# EAGLE board H19R00 (EAGLE 9.6.2)
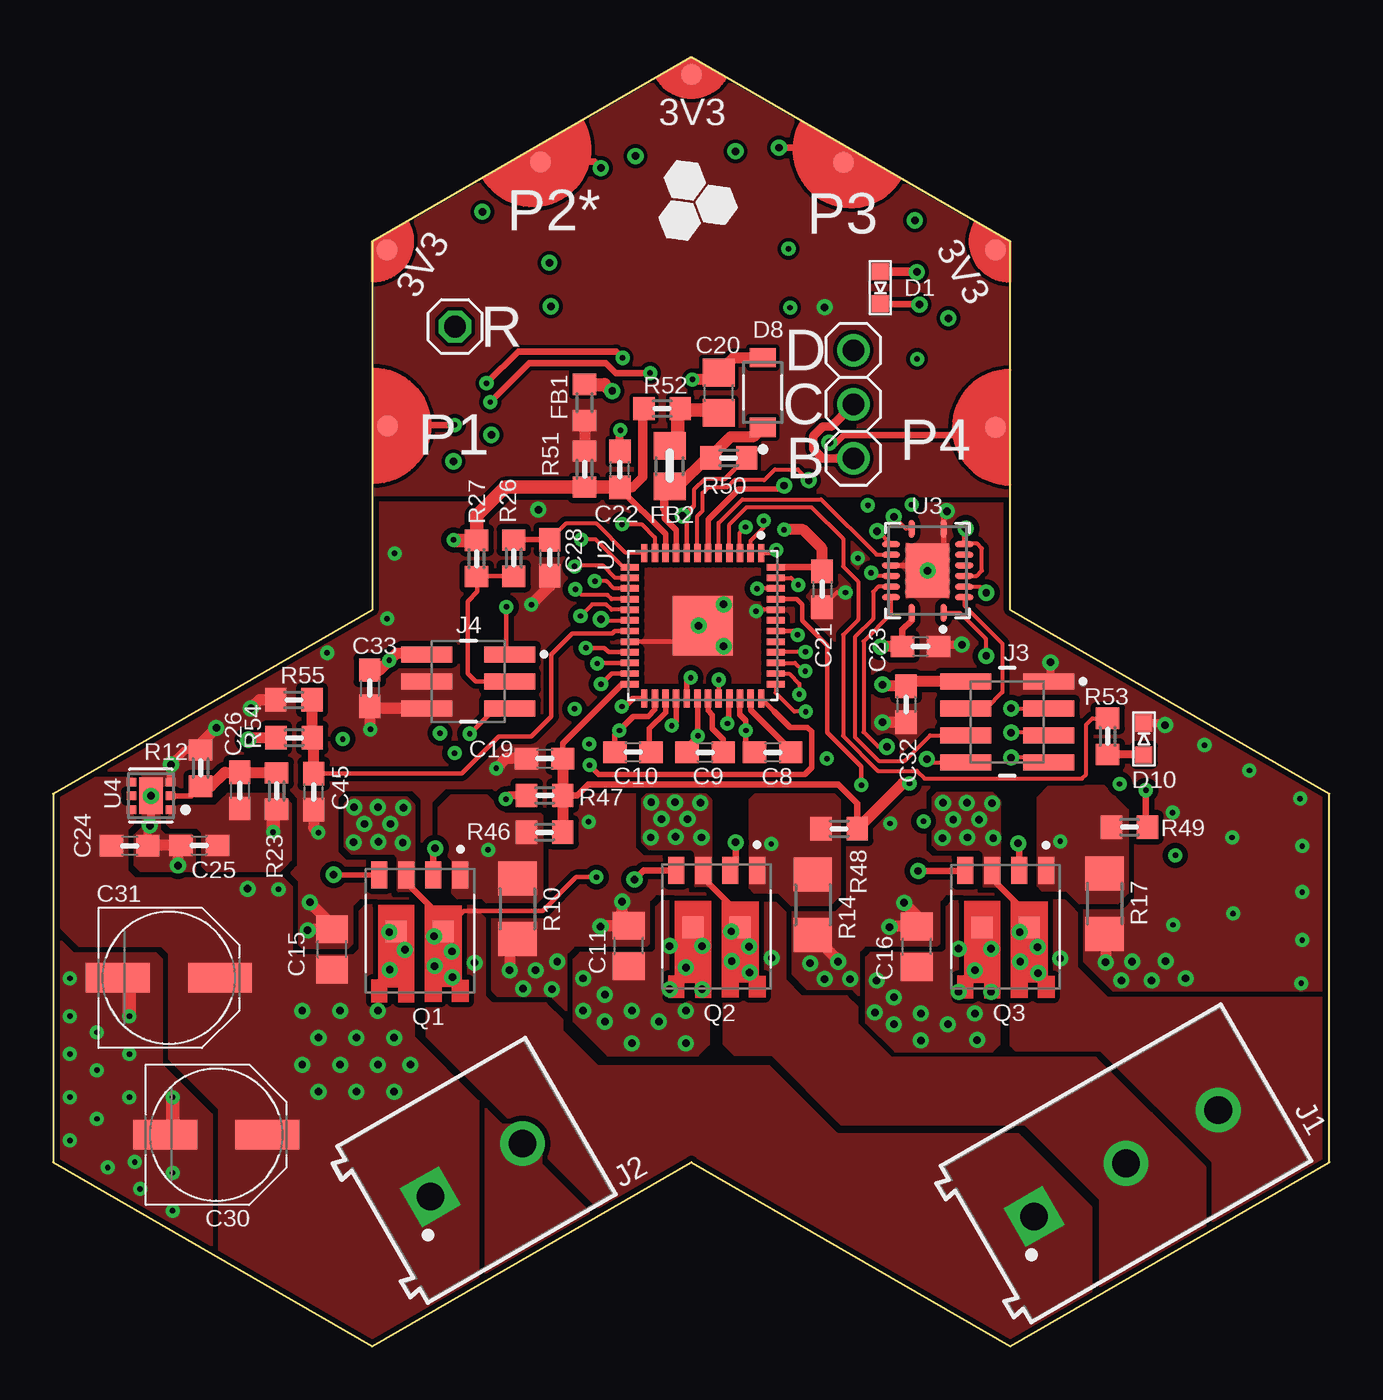
[diagram p3: board, top side]
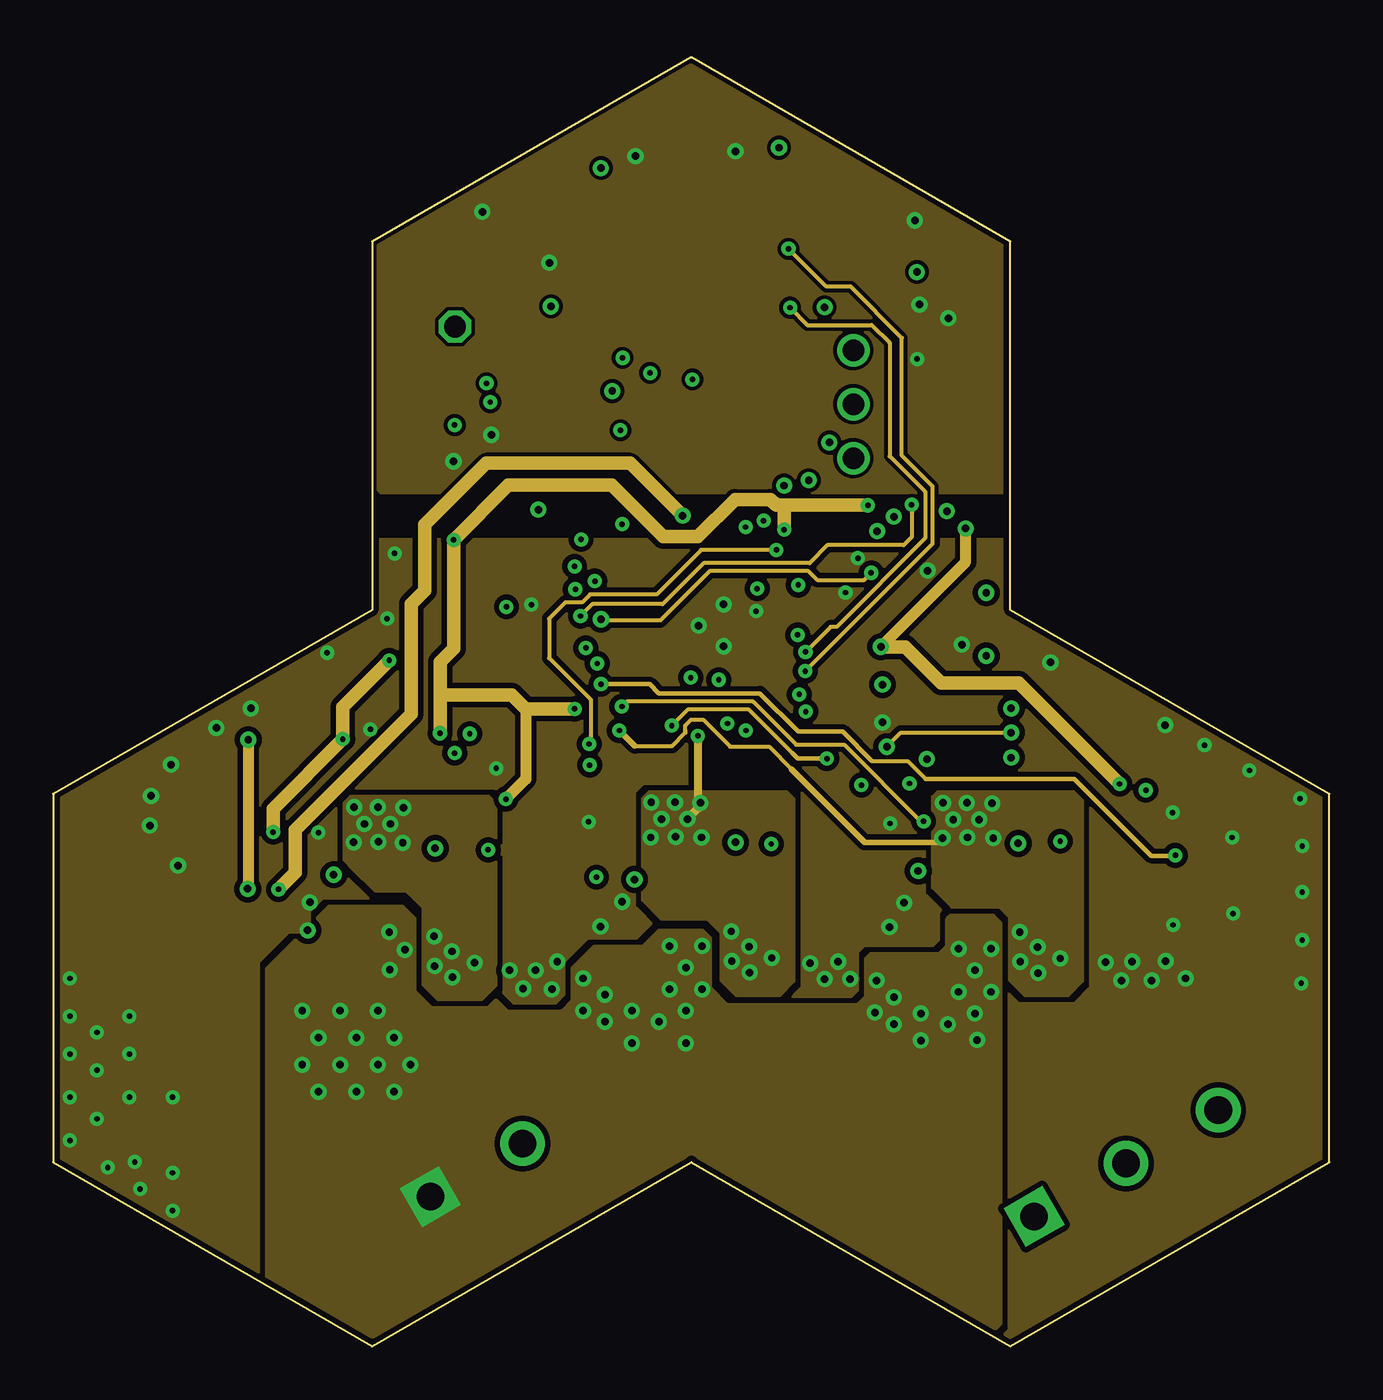
[diagram p4: board, inner layer Route2]
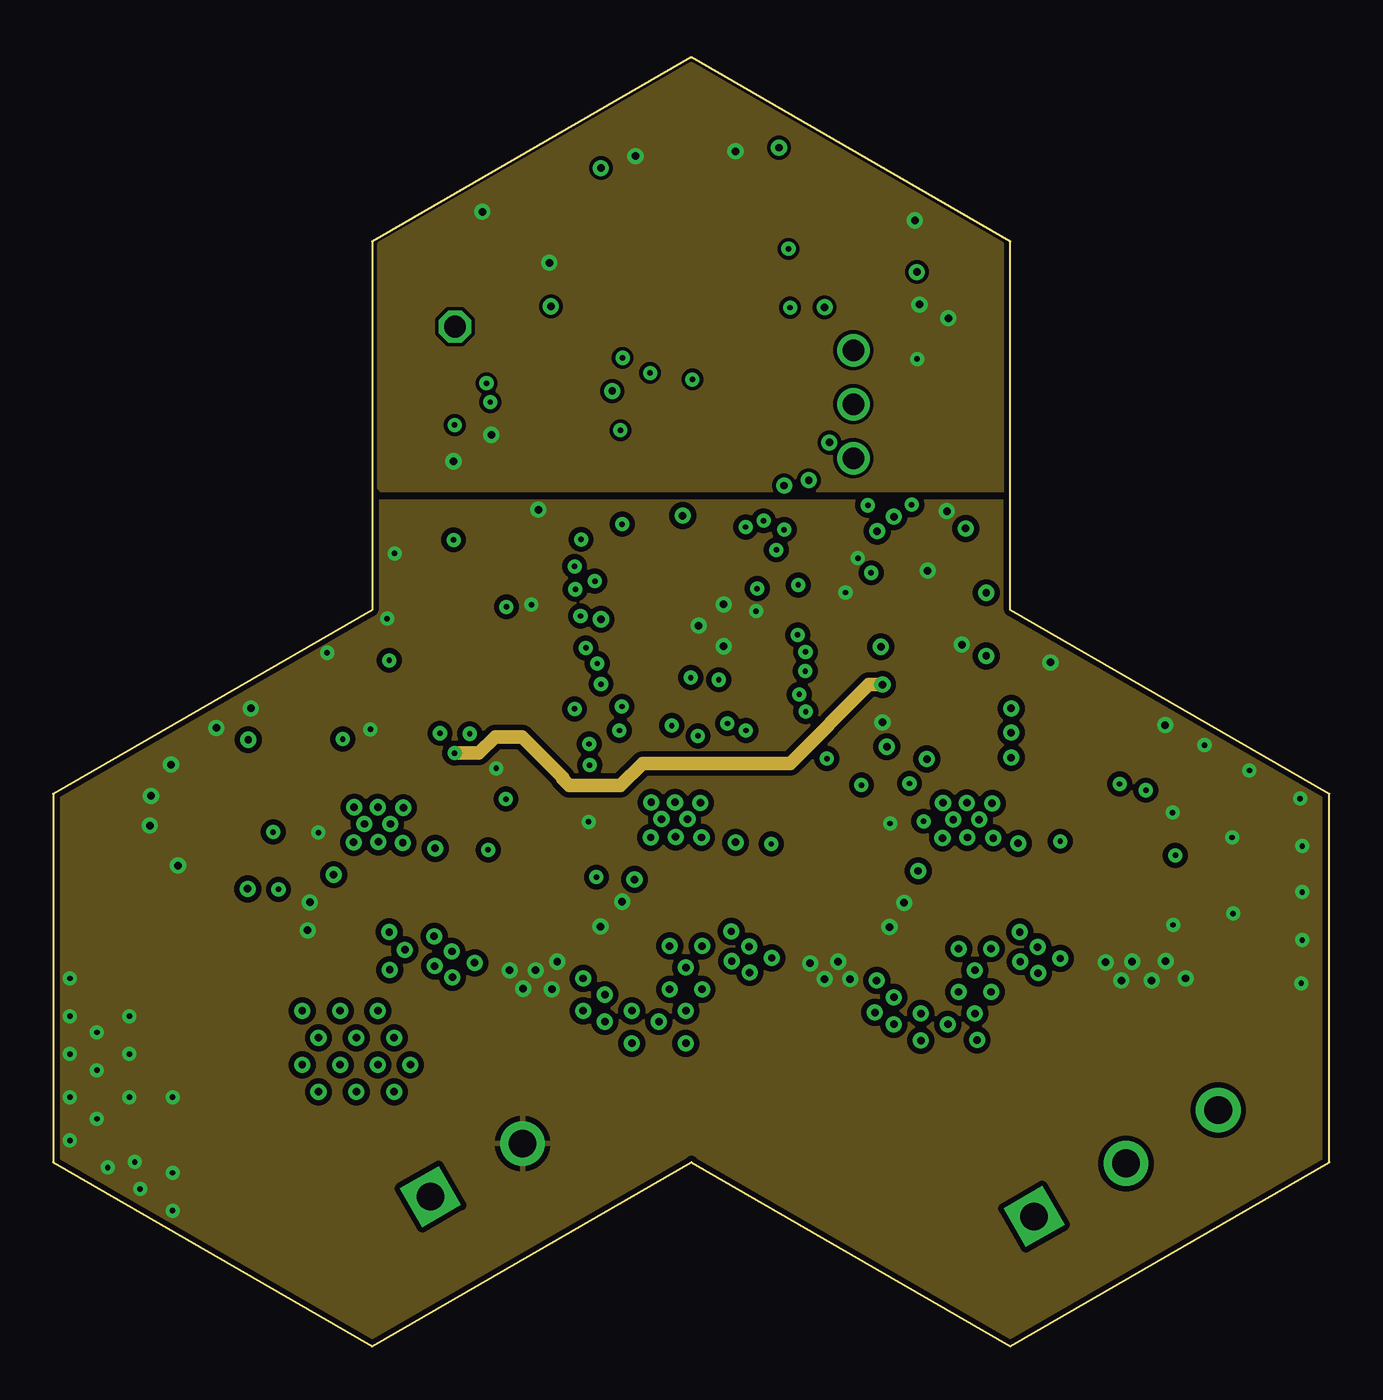
[diagram p5: board, inner layer Route15]
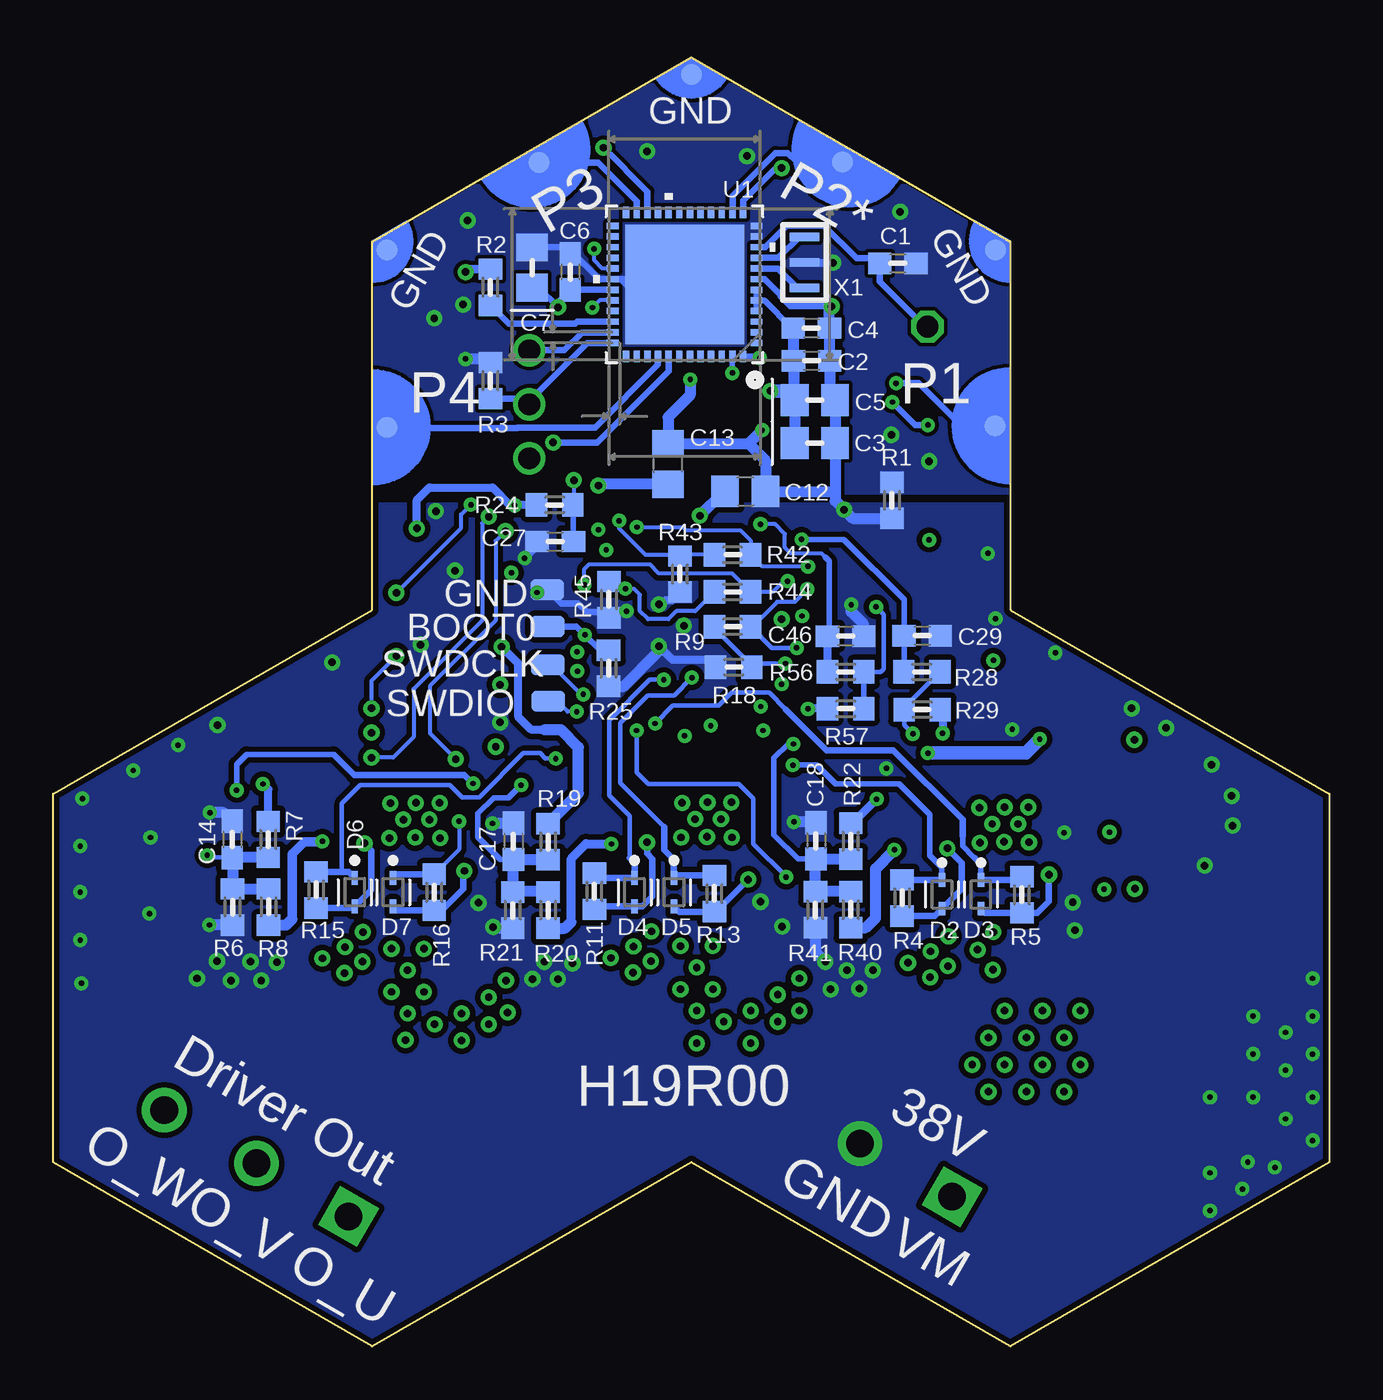
[diagram p6: board, bottom side, seen from below]

Size 60 x 60.62 mm. Coordinates in mm from the lower left corner, seen from the top.
Copper layers (1*2+15*16): Top 0.035mm / dielectric 0.175mm / Route2 0.035mm / dielectric 1.11mm / Route15 0.035mm / dielectric 0.175mm / Bottom 0.035mm
Design rules "4_layer *": minimum track width 7mil, minimum drill 10mil, track to track 7mil, track to pad 7mil, pad to pad 6mil, via to via 7mil, smd to smd 0mil, copper to edge 1mil, drill to drill 8mil, minimum pad ring 10mil, minimum via ring 8mil, stop-mask expansion 2mil, vias tented up to drill 15mil, thermal gap 10mil

## Footprints (pad centres in the part's own frame; a part is rotated, then mirrored left to right if it is on the bottom)
PAD4 = smd 1.6 x 1: P$1 0,0
C-0603 = smd 1.1 x 1: 1 -0.85,0; 2 0.85,0
C-0805-POL = smd 1.3 x 1.5: 1 -0.95,0; 2 0.95,0
C-0805 = smd 1.3 x 1.5: 1 -0.95,0; 2 0.95,0
PANASONIC_D = smd 3 x 1.4: + 2.4,0; - -2.4,0
VLMS1300-GS08 = smd 0.8 x 0.8: A 0,0.75; C 0,-0.75
STMICROELECTRONICS_BAT30KFILM_0 = smd 0.65 x 0.3: A 0.675,0; C -0.675,0
ONSEMI_MMSD4448_0 = smd 0.914 x 1.219: 1 -1.638,0; 2 1.638,0
FB-TDK_MMZ1608Y300B = smd 1 x 1.1: 1 -0.85,0; 2 0.85,0
FB-0805 = smd 1.3 x 1.5: 1 -0.95,0; 2 0.95,0
691213710003 = drill 1.3 pad 2.1 square: 1 -5,0 | drill 1.3 pad 2.1: 2 0,0; 3 5,0
691213710002 = drill 1.3 pad 2.1 square: 1 -2.5,0 | drill 1.3 pad 2.1: 2 2.5,0
AMPHENOL_20021121-00008T4LF = smd 0.76 x 2.4: 1 -1.905,1.95; 2 -1.905,-1.95; 3 -0.635,1.95; 4 -0.635,-1.95; 5 0.635,1.95; 6 0.635,-1.95; 7 1.905,1.95; 8 1.905,-1.95
AMPHENOL_20021121-00006C1LF = smd 0.76 x 2.4: 1 -1.27,1.95; 2 -1.27,-1.95; 3 0,1.95; 4 0,-1.95; 5 1.27,1.95; 6 1.27,-1.95
PJQ5866A_R2_00001-8-POWERTDFN = smd 1.27 x 0.75: 1 -2.67,1.905; 2 -2.67,0.635; 3 -2.67,-0.635; 4 -2.67,-1.905 | smd 1 x 1: 5_6 0,-1.107; 7_8 0,1.107
1X01 = drill 1.016 octagon: 1 0,0
R-0603 = smd 1 x 1.1: 1 -0.85,0; 2 0.85,0
R1206 = smd 1.6 x 1.803: 1 -1.422,0; 2 1.422,0
1X03 = drill 1.016: 1 -2.54,0; 2 0,0; 3 2.54,0
HEXABITZ_ICS_QFN_B1CEU6_STM-L = smd 0.55 x 0.3: 1 -3.38,2.751; 2 -3.38,2.251; 3 -3.38,1.75; 4 -3.38,1.25; 5 -3.38,0.75; 6 -3.38,0.25; 7 -3.38,-0.25; 8 -3.38,-0.75; 9 -3.38,-1.25; 10 -3.38,-1.75; 11 -3.38,-2.251; 12 -3.38,-2.751; 25 3.38,-2.751; 26 3.38,-2.251; 27 3.38,-1.75; 28 3.38,-1.25; 29 3.38,-0.75; 30 3.38,-0.25; 31 3.38,0.25; 32 3.38,0.75; 33 3.38,1.25; 34 3.38,1.75; 35 3.38,2.251; 36 3.38,2.751 | smd 0.3 x 0.55: 13 -2.751,-3.38; 14 -2.251,-3.38; 15 -1.75,-3.38; 16 -1.25,-3.38; 17 -0.75,-3.38; 18 -0.25,-3.38; 19 0.25,-3.38; 20 0.75,-3.38; 21 1.25,-3.38; 22 1.75,-3.38; 23 2.251,-3.38; 24 2.751,-3.38; 37 2.751,3.38; 38 2.251,3.38; 39 1.75,3.38; 40 1.25,3.38; 41 0.75,3.38; 42 0.25,3.38; 43 -0.25,3.38; 44 -0.75,3.38; 45 -1.25,3.38; 46 -1.75,3.38; 47 -2.251,3.38; 48 -2.751,3.38 | smd 5.6 x 5.6: 49 0,0
IC_STSPIN32F0A = smd 0.85 x 0.3: 1 -3.425,2.75; 2 -3.425,2.25; 3 -3.425,1.75; 4 -3.425,1.25; 5 -3.425,0.75; 6 -3.425,0.25; 7 -3.425,-0.25; 8 -3.425,-0.75; 9 -3.425,-1.25; 10 -3.425,-1.75; 11 -3.425,-2.25; 12 -3.425,-2.75; 25 3.425,-2.75; 26 3.425,-2.25; 27 3.425,-1.75; 28 3.425,-1.25; 29 3.425,-0.75; 30 3.425,-0.25; 31 3.425,0.25; 32 3.425,0.75; 33 3.425,1.25; 34 3.425,1.75; 35 3.425,2.25; 36 3.425,2.75 | smd 0.3 x 0.85: 13 -2.75,-3.425; 14 -2.25,-3.425; 15 -1.75,-3.425; 16 -1.25,-3.425; 17 -0.75,-3.425; 18 -0.25,-3.425; 19 0.25,-3.425; 20 0.75,-3.425; 21 1.25,-3.425; 22 1.75,-3.425; 23 2.25,-3.425; 24 2.75,-3.425; 37 2.75,3.425; 38 2.25,3.425; 39 1.75,3.425; 40 1.25,3.425; 41 0.75,3.425; 42 0.25,3.425; 43 -0.25,3.425; 44 -0.75,3.425; 45 -1.25,3.425; 46 -1.75,3.425; 47 -2.25,3.425; 48 -2.75,3.425 | smd 2.8 x 2.8: 49 0,0
TEXAS_INSTRUMENTS_AM26LV32EIRGYR_0 = smd 0.85 x 0.28: 1 -1.975,-0.75; 8 1.975,-0.75; 9 1.975,0.75; 16 -1.975,0.75 | smd 0.28 x 0.85: 2 -1.25,-1.725; 3 -0.75,-1.725; 4 -0.25,-1.725; 5 0.25,-1.725; 6 0.75,-1.725; 7 1.25,-1.725; 10 1.25,1.725; 11 0.75,1.725; 12 0.25,1.725; 13 -0.25,1.725; 14 -0.75,1.725; 15 -1.25,1.725 | smd 2.55 x 2.05: 17 0,0
ON_SEMI_NCP730BMTADJTBG_0 = smd 0.45 x 0.4: 1 -0.925,0.65; 2 -0.925,0; 3 -0.925,-0.65; 4 0.925,-0.65; 5 0.925,0; 6 0.925,0.65 | smd 1.12 x 1.72: 7 0,0
HEXABIT_17.32_X3_NO_P1_P2_P3_P4_P5_P6_P11_P12 = smd 1 x 1 bottom: PAD_PD1 -21.88,-6.86; PAD_PD2 -21.84,7.39; PAD_PD12 -25.99,0.24 | smd 1 x 1 rotated 240 bottom: PAD_PD3 -9.468,-14.037; PAD_PD8 -9.394,14.542 | smd 1 x 1 rotated 60 bottom: PAD_PD17 -17.741,-14.056 | smd 1 x 1 rotated 300 bottom: PAD_PD19 -17.727,14.55 | smd 1 x 1: PAD_PU1 -21.88,-6.86; PAD_PU2 -21.84,7.39; PAD_PU12 -25.99,0.24 | smd 1 x 1 rotated 240: PAD_PU3 -9.468,-14.037; PAD_PU8 -9.394,14.542 | smd 1 x 1 rotated 60: PAD_PU17 -17.741,-14.056 | smd 1 x 1 rotated 300: PAD_PU19 -17.727,14.55
XTALL_CSTCE8M00G52 = smd 1.4 x 0.4: P$1 0,1.2; P$2 0,0; P$3 0,-1.2

## Placement (x,y rotation side)
BOOT0  PAD4  [PAD4]  36.75,33.86 0 bottom
C1  100nF  [C-0603]  20.29,50.93 180 bottom
C2  100nF  [C-0603]  24.34,46.35 180 bottom
C3  4.7uF  [C-0805-POL]  24.19,42.48 0 bottom
C4  100nF  [C-0603]  24.35,47.88 180 bottom
C5  1uF  [C-0805-POL]  24.19,44.51 0 bottom
C6  100nF  [C-0603]  35.69,50.53 270 bottom
C7  4.7uF  [C-0805-POL]  37.49,50.74 90 bottom
C8  470nF  [C-0603]  33.83,27.94 0 top
C9  470nF  [C-0603]  30.65,27.94 0 top
C10  470nF  [C-0603]  27.26,27.95 0 top
C11  150nF  [C-0805]  27.06,18.83 90 top
C12  10uF  [C-0805]  27.46,40.21 0 bottom
C13  10uF  [C-0805]  31.09,41.5 90 bottom
C14  33pF  [C-0603]  51.58,23.84 270 bottom
C15  150nF  [C-0805]  13.11,18.67 90 top
C16  150nF  [C-0805]  40.6,18.8 90 top
C17  33pF  [C-0603]  38.36,23.75 270 bottom
C18  33pF  [C-0603]  24.14,23.77 270 bottom
C19  1nF  [C-0603]  23.11,27.64 0 top
C20  47uF  [C-0805]  31.3,44.85 90 top
C21  100nF  [C-0603]  36.15,35.61 270 top
C22  100nF  [C-0603]  26.65,41.24 90 top
C23  100nF  [C-0603]  40.78,32.91 180 top
C24  1uF  [C-0603]  3.6,23.54 180 top
C25  1uF  [C-0603]  6.87,23.56 0 top
C26  1nF  [C-0603]  8.77,26.15 270 top
C27  1nF  [C-0603]  36.4,37.85 0 bottom
C28  220pF  [C-0603]  23.35,37.09 90 top
C29  220pF  [C-0603]  19.14,33.42 180 bottom
C30  47uF  [PANASONIC_D]  7.66,9.95 0 top
C31  47uF  [PANASONIC_D]  5.44,17.34 0 top
C32  10nF  [C-0603]  40.09,30.19 270 top
C33  10nF  [C-0603]  14.89,30.96 270 top
C45  2.2nF  [C-0603]  12.25,26.08 90 top
C46  220pF  [C-0603]  22.74,33.4 180 bottom
D1  RED  [VLMS1300-GS08]  38.89,49.78 0 top
D2  BAT30KFILM  [STMICROELECTRONICS_BAT30KFILM_0]  18.21,21.26 270 bottom
D3  BAT30KFILM  [STMICROELECTRONICS_BAT30KFILM_0]  16.39,21.26 270 bottom
D4  BAT30KFILM  [STMICROELECTRONICS_BAT30KFILM_0]  32.67,21.36 270 bottom
D5  BAT30KFILM  [STMICROELECTRONICS_BAT30KFILM_0]  30.81,21.36 270 bottom
D6  BAT30KFILM  [STMICROELECTRONICS_BAT30KFILM_0]  45.82,21.36 270 bottom
D7  BAT30KFILM  [STMICROELECTRONICS_BAT30KFILM_0]  44.02,21.36 270 bottom
D8  MMSD4448ONSEMI_MMSD4448_0_0  [ONSEMI_MMSD4448_0]  33.36,44.86 90 top
D10  RED  [VLMS1300-GS08]  51.28,28.57 180 top
FB1  [FB-TDK_MMZ1608Y300B]  24.98,44.39 90 top
FB2  22uH  [FB-0805]  28.98,41.4 90 top
GND  PAD4  [PAD4]  36.77,35.58 0 bottom
J1  691213710003  [691213710003]  50.45,8.6 30 top
J2  691213710002  [691213710002]  19.9,8.29 30 top
J3  20021121-00008T4LFU  [AMPHENOL_20021121-00008T4LF]  44.86,29.37 270 top
J4  20021121-00006C1LF  [AMPHENOL_20021121-00006C1LF]  19.52,31.27 270 top
Q1  [PJQ5866A_R2_00001-8-POWERTDFN]  17.23,19.51 270 top
Q2  [PJQ5866A_R2_00001-8-POWERTDFN]  31.19,19.72 270 top
Q3  [PJQ5866A_R2_00001-8-POWERTDFN]  44.78,19.7 270 top
R  [1X01]  18.89,47.96 0 top
R1  0.0R  [R-0603]  20.56,39.79 270 bottom
R2  270R  [R-0603]  39.44,49.81 270 bottom
R3  10K  [R-0603]  39.44,45.42 270 bottom
R4  100  [R-0603]  20.09,21.08 90 bottom
R5  100  [R-0603]  14.46,21.23 90 bottom
R6  21K  [R-0603]  51.57,20.66 270 bottom
R7  21K  [R-0603]  49.89,23.84 270 bottom
R8  2.4K  [R-0603]  49.87,20.66 90 bottom
R9  10.5K  [R-0603]  28.06,33.85 0 bottom
R10  0.100R  [R1206]  21.82,20.57 90 top
R11  100  [R-0603]  34.55,21.4 90 bottom
R12  750K  [R-0603]  6.93,27.19 90 top
R13  100  [R-0603]  28.92,21.29 90 bottom
R14  0.100R  [R1206]  35.71,20.76 90 top
R15  100  [R-0603]  47.64,21.46 90 bottom
R16  100  [R-0603]  42.09,21.36 90 bottom
R17  0.100R  [R1206]  49.43,20.83 90 top
R18  2.4K  [R-0603]  28.01,31.94 0 bottom
R19  21K  [R-0603]  36.73,23.73 270 bottom
R20  2.4K  [R-0603]  36.73,20.51 90 bottom
R21  21K  [R-0603]  38.4,20.51 270 bottom
R22  21K  [R-0603]  22.5,23.76 270 bottom
R23  2.4M  [R-0603]  10.5,26.11 90 top
R24  12K  [R-0603]  36.43,39.58 180 bottom
R25  100K  [R-0603]  33.89,31.89 270 bottom
R26  1K  [R-0603]  21.65,37.07 90 top
R27  12K  [R-0603]  19.9,37.06 270 top
R28  1K  [R-0603]  19.16,31.72 180 bottom
R29  12K  [R-0603]  19.14,29.94 180 bottom
R40  2.4K  [R-0603]  22.5,20.54 90 bottom
R41  21K  [R-0603]  24.17,20.54 270 bottom
R42  10.5K  [R-0603]  28.06,37.23 0 bottom
R43  2.4K  [R-0603]  30.54,36.32 90 bottom
R44  10.5K  [R-0603]  28.06,35.48 0 bottom
R45  2.4K  [R-0603]  33.87,35.12 90 bottom
R46  2.2K  [R-0603]  23.11,24.18 180 top
R47  18K  [R-0603]  23.11,25.91 0 top
R48  2.2K  [R-0603]  36.95,24.34 180 top
R49  2.2K  [R-0603]  50.6,24.42 180 top
R50  DNP  [R-0603]  31.76,41.78 180 top
R51  DNP  [R-0603]  24.98,41.26 270 top
R52  0R  [R-0603]  28.63,44.1 180 top
R53  270R  [R-0603]  49.57,28.69 90 top
R54  180K  [R-0603]  11.33,28.62 0 top
R55  10K  [R-0603]  11.31,30.4 0 top
R56  1K  [R-0603]  22.74,31.72 180 bottom
R57  12K  [R-0603]  22.74,29.99 0 bottom
SWD  [1X03]  37.62,44.31 90 top
SWDCLK  PAD4  [PAD4]  36.75,32.05 180 bottom
SWDIO  PAD4  [PAD4]  36.72,30.34 0 bottom
U1  STM32G0B1CEU6N  [HEXABITZ_ICS_QFN_B1CEU6_STM-L]  30.32,49.94 180 bottom
U2  STSPIN32F0A  [IC_STSPIN32F0A]  30.54,33.89 270 top
U3  AM26LV32EIRGYRTEXAS_INSTRUMENTS_AM26LV32EIRGYR_0_0  [TEXAS_INSTRUMENTS_AM26LV32EIRGYR_0]  41.11,36.48 90 top
U4  NCP730BMTADJTBGON_SEMI_NCP730BMTADJTBG_0_0  [ON_SEMI_NCP730BMTADJTBG_0]  4.6,25.89 180 top
U$1  HEXABIT_17.32_X3_NO_P1_P2_P3_P4_P5_P6_P11_P12  [HEXABIT_17.32_X3_NO_P1_P2_P3_P4_P5_P6_P11_P12]  29.76,33.83 270 top
X1  8MHZ  [XTALL_CSTCE8M00G52]  24.68,50.97 180 bottom

## Tracks (layer width: path | path; a pad name or v marks a point on that pad's centre or on a via)
+5V  (via drill 0.25 pad 0.51, 0.35)
  Top 0.508: J3.2 40.32,31.27 C32.1 39.07,31.05 v38.99,31.12 | J4.2 17.52,32.6 16.13,32.6 v15.8,32.27 15.34,31.81 C33.1
  Top 0.635: R23.1 10.34,25.1 v10.34,24.19
  Route2 0.635: v10.34,24.19 10.34,25.28 v13.62,28.56 13.62,30.08 v15.8,32.27
  Route15 0.635: v18.87,27.9 20.02,27.9 20.78,28.66 22.05,28.66 23.95,26.75 23.95,26.68 24.26,26.37 26.67,26.37 27.71,27.41 34.65,27.41 38.36,31.12 v38.99,31.12
  Bottom 0.635: v13.62,28.56 14.28,27.9 v18.87,27.9
  pour Top (isolate 0.254, no thermals): 5.36,25.36 5.36,24.57 5.46,24.47 5.51,24.42 5.82,24.42 6.76,24.42 6.91,24.26 7.01,24.16 7.01,23.45 7.01,22.59 7.21,22.38 8.94,22.38 10.67,22.38 10.95,22.66 11.18,22.89 11.18,24.97 11.18,25.51 10.97,25.71 10.72,25.97 9.88,25.97 8.2,25.97 7.93,25.69 7.62,25.38 5.51,25.38 5.39,25.38
C
  Top 0.406: SWD.1 36.83,41.77 36.81,41.75 36.18,41.75 35.73,42.19 35.73,42.82 36.18,43.27 36.58,43.27 SWD.2
  Bottom 0.305: U1.36 34.89,47.19 37.62,44.46 SWD.2 37.88,44.57 R3.2
D
  Bottom 0.305: U1.35 33.71,47.68 35.14,47.68 35.96,46.85 SWD.3
ENC_A
  Top 0.178: U3.2 42.84,34.85 44.63,33.05 44.63,30.77 43.87,30 J3.4
ENC_B
  Top 0.178: U3.14 38.8,35.73 38.55,35.48 38.55,34.21 37.69,33.36 37.69,28.66 38.81,27.54 40.03,27.54 41.23,28.73 J3.6
ENC_I  (via drill 0.35)
  Top 0.178: U3.10 38.78,38.34 v38.74,38.34 | v41.07,27.62 41.23,27.46 J3.8
  Bottom 0.178: v38.74,38.34 39.19,37.88 39.19,34.14 42.29,31.05 42.29,28.84 v41.07,27.62
ENC_NA  (via drill 0.35)
  Top 0.178: U3.1 42.62,34.51 43.84,33.28 43.84,32.47 v43.87,32.47 | v45.04,30 J3.3
  Bottom 0.178: v43.87,32.47 45.04,31.3 v45.04,30
ENC_NB  (via drill 0.35)
  Top 0.178: U3.15 39.39,34.44 38.1,33.15 38.1,28.89 38.79,28.2 v39.19,28.2 | v45.04,28.86 46.68,28.86 J3.5
  Route2 0.178: v39.19,28.2 39.85,28.86 v45.04,28.86
ENC_NI  (via drill 0.35)
  Top 0.178: U3.9 40.09,38.46 v39.52,39.02 | v45.04,27.69 46.58,27.69 J3.7
  Bottom 0.178: v39.52,39.02 39.83,38.72 39.83,34.14 43.05,30.92 43.05,28.66 44.02,27.69 v45.04,27.69
G0_USART1_RX  (via drill 0.25 pad 0.51)
  Top 0.178: v35.37,32.66 35.36,32.64 U2.40
  Route2 0.178: v34.65,48.85 35.46,48.04 38.48,48.04 39.32,47.2 39.32,41.87 41,40.19 41,38.01 36.83,33.84 36.55,33.84 v35.37,32.66
  Bottom 0.178: U1.32 34.31,49.19 v34.65,48.85
G0_USART1_TX  (via drill 0.25 pad 0.51)
  Top 0.178: U2.39 34.87,32.14 35.26,31.76 v35.36,31.76
  Route2 0.178: v35.36,31.76 41.35,37.75 41.35,40.44 39.9,41.89 39.9,47.43 37.49,49.84 36.35,49.84 v34.57,51.62
  Bottom 0.178: U1.29 34.18,50.69 34.57,51.09 v34.57,51.62
GND  (via drill 0.25 pad 0.51, 0.35)
  Top 0.305: D1.C 38.91,49.01 40.71,49.01 v40.73,48.99
  Bottom 0.305: C7.2 35.9,51.69 35.69,51.48 | C6.1 35.69,51.48 | 35.69,51.48 35.61,51.41 35.61,51.48 34.32,50.19 U1.30 33.06,50.19 33.04,50.18 33.29,50.18 33.05,49.94 U1.49
  Bottom 0.381: X1.P$2 23.35,50.98 v23.33,50.96
  Bottom 0.508: R3.1 39.61,46.44 v40.62,46.44
  other vias: 27.38,55.98 20.18,53.36 32.08,56.2 40.51,52.95 42.09,48.36 20.6,42.87 18.82,41.62
  pour Bottom (rank 2, no thermals): 45.07,40.1 15.08,40.18 15.08,51.69 30,60.42 45,51.85
  pour Route15 (rank 2): 15.39,40.24 44.63,40.24 44.65,40.21 44.65,51.85 30,60.36 15.29,51.85 15.29,40.34
  pour Route2 (rank 2): 15.37,40.16 44.6,40.16 44.63,40.14 44.63,51.77 29.97,60.28 15.27,51.77 15.27,40.27
GND1  (via drill 0.25 pad 0.51, 0.35)
  Top 0.178: U2.44 33.11,34.64 v33.05,34.58 | C21.2 36.85,35.45 v37.25,35.45
  Top 0.203: U2.20 29.6,33.14 v30.35,33.89
  Top 0.254: U3.12 40.86,36.73 U3.17 41.86,37.23 U3.8 41.86,39.12 v42.01,39.28
  Top 0.305: v31.52,34.89 31.35,34.89 v30.35,33.89
  Top 0.381: U4.3 5.52,27.35 v5.54,27.36 6.22,28.04 R12.2 | C24.1 4.45,24.39 v4.55,24.49 4.6,24.54 U4.7 | C23.1 41.72,33 v42.72,33 | D10.C 52.18,29.32 v52.27,29.22 | J3.1 46.89,31.36 v46.89,32.16 | C22.2 26.65,43.06 v26.67,43.09
  Top 0.508: R10.1 21.46,18.79 v21.46,17.69 | v25.73,19.74 25.77,19.78 C11.2 26.75,20.09 v26.75,20.91 | v11.96,19.57 12.02,19.62 C15.2 13.11,19.84 v12.07,20.89 | v39.32,19.72 39.35,19.75 C16.2 40.6,20.26 v40.01,20.86 | C24.1 4.46,23.56 C25.1 5.87,23.41 v5.87,22.61 | R55.1 9.69,30.4 v9.3,30 | R12.2 6.93,28.35 v7.67,29.09 | C32.2 v38.99,29.35 v38.99,29.34 | C19.1 21.28,27.64 v20.83,27.19 | C45.1 12.25,24.38 v12.47,24.16 | J4.6 14.99,30 C33.2 14.89,29.04 v14.91,29.01 | D8.2 32,46.5 C20.2 30.98,45.47 v30.05,45.47 | v22.48,34.88 23.35,35.75 C28.1 | R14.1 36.91,18.15 v36.91,18.09 | R17.1 49.48,19.36 v49.48,18.07
  Top 0.635: C31.- 3.58,16.79 v3.58,15.53 | v5.61,11.72 5.61,10.31 C30.-
  Bottom 0.178: GND.P$1 37.12,35.58 v37.25,35.45
  Bottom 0.305: v23.4,48.91 23.42,48.91 25.34,48.91 25.79,49.36 25.79,49.44 26.54,50.19 U1.7 | v30.35,33.89 30.36,33.89 | GND.P$1 36.12,34.93 35.31,34.93 34.9,34.53 33.45,34.53 33.4,34.58
  Bottom 0.381: R18.1 29.22,32.3 30.89,32.3 v31.52,32.93 | v31.52,34.89 31.41,34.89 31.2,35.1 30.91,35.1 R43.1 | R45.1 33.56,34.58 33.4,34.58 v33.05,34.58 | C27.1 37.25,37.69 37.85,37.09 v37.83,37.07
  Bottom 0.508: R21.2 39.26,19.66 v39.32,19.72 | R6.2 v52.66,19.82 | C14.1 52,25.1 v52.63,25.1 | C17.1 v39.34,24.6 v39.35,24.59 | 23.42,48.91 23.5,48.83 C4.1 23.5,46.37 C2.1 23.49,44.76 C5.2 C3.2 23.24,40.27 | 23.24,40.27 23.24,39.78 v22.81,39.35 22.4,38.94 R1.2 | 23.24,40.27 23.29,40.21 C12.2 26.51,41.65 27.31,42.45 | 27.31,42.45 C13.2 31.09,43.69 30.05,44.74 v30.05,45.47 | 27.31,42.45 v26.67,43.09 | C46.1 21.89,33.96 22.48,34.55 v22.48,34.88 | R41.2 24.17,18.56 v23.7,18.09 | C18.1 24.18,24.67 v25.17,24.67 | R25.2 33.18,31.04 31.52,32.7 v31.52,32.93
  other vias: 22.68,17.69 22.1,16.82 23.44,16.8 35.59,18.02 36.27,17.28 37.47,17.28 50.72,18.09 50.22,17.2 51.64,17.2 52.3,18.12 53.24,17.3 4.6,25.89 41.11,36.48 0.79,17.3 0.79,15.53 0.79,13.75 0.79,11.72 0.79,9.68 2.57,8.41 4.09,7.4 5.61,6.38 5.61,8.16 3.84,8.67 2.06,10.7 2.06,14.76 3.58,13.75 2.06,12.99 3.58,11.72 12.88,32.62 16.05,37.29 15.7,34.22 54.13,28.28 56.24,27.08 58.62,25.76 58.73,23.53 58.73,21.37 58.73,19.11 58.67,17.08 55.47,20.35 55.42,23.93
  pour Top (isolate 0.254, rank 3, no thermals): -0.28,8.29 -0.28,0.24 0.31,-0.35 0.97,-1.01 44.5,-1.01 58.73,-1.01 59.49,-0.25 60.35,0.62 60.35,13.8 60.35,37.52 58.01,39.86 15.8,39.86 3.89,39.86 2.01,37.98 -0.28,35.69
  pour Route15 (isolate 0.254): -0.43,35.77 -0.43,0.31 0.81,-0.93 58.57,-0.93 60.2,0.69 60.2,37.6 58.04,39.76 3.56,39.76
  pour Bottom (isolate 0.254, rank 3, no thermals): -0.38,8.06 -0.38,0.01 0.2,-0.58 0.86,-1.24 44.4,-1.24 58.62,-1.24 59.39,-0.48 60.25,0.39 60.25,13.57 60.25,37.29 57.91,39.63 15.7,39.63 3.79,39.63 1.91,37.75 -0.38,35.47
  pour Route2 (isolate 0.254, rank 3, no thermals): -0.3,35.31 -0.3,-0.15 0.94,-1.39 58.7,-1.39 60.33,0.24 60.33,37.14 59.51,37.95 2.34,37.95
H1  (via drill 0.25 pad 0.51)
  Top 0.203: v21.31,34.78 21.31,32.7 J4.1
  Bottom 0.203: R56.1 21.1,31.72 20.96,31.86 20.96,34.42 v21.31,34.78
  Bottom 0.254: R57.2 R56.1
H2
  Top 0.203: R26.1 19.94,36.22 | 19.94,36.22 19.92,36.22 R27.2 | J4.3 19.86,31.27 19.48,31.66 19.48,35.03 19.94,35.49 19.94,36.22
H3  (via drill 0.25 pad 0.51)
  Top 0.203: J4.5 20.78,30 v19.58,28.81
  Bottom 0.203: v19.58,28.81 19.99,29.22 R29.2 19.99,30.04 R28.1
HSU  (via drill 0.25 pad 0.51)
  Top 0.254: U2.33 31.77,30.45 31.77,29.29 v31.7,29.29
  Bottom 0.203: v31.7,29.29 30.86,30.13 28.7,30.13 28.09,30.74 26.34,30.74 25.55,29.95
  Bottom 0.254: 17.25,24.01 17.25,23.53 16.72,23 16.69,23 16.39,22.69 D3.C
  Bottom 0.305: D3.C 14.61,21.93 R5.2 | 25.55,29.95 23.62,28.02 20.5,28.02 17.25,24.77 17.25,24.01
HSV  (via drill 0.25 pad 0.51)
  Top 0.254: U2.29 29.8,31.27 v29.97,31.45
  Bottom 0.203: v29.97,31.45 30.81,30.61 32.06,30.61 33.35,29.32 33.35,26.5 31.27,24.42
  Bottom 0.305: R13.2 30.7,22.14 D5.C 30.81,22.89 31.27,23.35 31.27,24.42
HSW  (via drill 0.25 pad 0.51)
  Top 0.254: U2.25 27.24,30.47 26.8,30.03 v26.73,30.09
  Route2 0.178: v26.73,30.09 26.96,30.32 32.91,30.32 34.93,28.3 37.19,28.3 40.79,24.7 v40.92,24.7
  Bottom 0.178: v40.92,24.7 40.92,23.37 R16.2
  Bottom 0.305: R16.2 43.85,22.21 D7.C
ISNSU  (via drill 0.25 pad 0.51)
  Bottom 0.508: R40.1 21.8,19.69 21.34,20.15 21.34,22.46 v20.45,23.35
  pour Top (isolate 0.254, no thermals): 18.77,22.87 18.77,21.32 18.97,21.11 20.14,21.11 20.42,20.83 22.68,20.83 22.99,21.14 22.99,24.95 22.91,25.03 21.26,25.03 20.4,25.89 18.7,25.89 18.14,25.33 18.14,23.5
ISNSV  (via drill 0.25 pad 0.51)
  Bottom 0.432: 35.66,19.95 35.64,19.97 35.64,22.94 34.95,23.63 v33.76,23.63
  Bottom 0.508: R20.1 35.95,19.66 35.66,19.95
  pour Top (isolate 0.254, no thermals): 32.74,25.69 32.74,21.57 32.94,21.37 34.09,21.37 34.67,20.78 36.53,20.78 36.98,21.24 36.98,25.81 36.75,26.04 33.1,26.04
ISNSW  (via drill 0.25 pad 0.51)
  Bottom 0.457: 48.77,20.1 48.77,23.15 48.18,23.73 47.37,23.73 v47.35,23.76
  Bottom 0.508: R8.1 49.05,19.81 48.77,20.1
  pour Top (isolate 0.254, no thermals): 46.28,25.79 46.28,21.67 46.48,21.47 47.63,21.47 48.21,20.89 50.06,20.89 50.52,21.34 50.52,25.2 49.4,26.32 46.81,26.32
LSU  (via drill 0.25 pad 0.51)
  Top 0.203: U2.36 33.91,29.85
  Top 0.254: 33.91,29.85 34.65,29.12 35.46,29.12 35.66,28.91 35.66,27.24 35.33,26.91 25.66,26.91 v25.22,27.34
  Bottom 0.254: v25.22,27.34 24.11,27.34 23.22,26.45 20.22,26.45 18.8,25.03 18.8,23.1 18.21,22.51 D2.C
  Bottom 0.305: D2.C R4.2
LSV  (via drill 0.25 pad 0.51)
  Top 0.203: U2.32 v31.29,31.35
  Bottom 0.203: v31.29,31.35 31.95,31.35 33.86,29.45 33.86,25.92 32.89,24.95 32.89,22.97
  Bottom 0.305: R11.2 34.34,22.03 D4.C 32.67,22.74 32.89,22.97
LSW  (via drill 0.25 pad 0.51)
  Top 0.254: U2.28 29.29,29.4 v29.08,29.19
  Route2 0.178: v29.08,29.19 29.86,29.97 32.68,29.97 34.75,27.9
  Route2 0.203: 34.75,27.9 35,27.64 v36.37,27.64
  Bottom 0.203: 46.43,22.31 46.43,25.53 45.57,26.4 41.35,26.4 40.77,25.81 39.98,25.81 37.9,27.9 37.11,27.9 36.86,27.64 v36.37,27.64
  Bottom 0.305: D6.C 46.11,22.31 46.43,22.31 R15.2
N$1
  Bottom 0.305: X1.P$1 25.01,49.78 25.92,50.69 U1.8
N$2
  Bottom 0.305: U1.9 25.9,51.19 24.92,52.18 X1.P$3
N$3
  Bottom 0.305: U1.34 35.36,48.19 35.46,48.09 38.58,48.09 R2.2
N$4  (via drill 0.35)
  Top 0.406: v40.61,50.53 v40.6,50.53 D1.A
  Bottom 0.406: R2.1 40.47,50.66 v40.61,50.53
N$5  (via drill 0.25 pad 0.51)
  Top 0.178: v33.4,38.83 33.4,38.5 32.79,37.89 U2.2
  Bottom 0.178: R42.1 30.48,37.23 30.52,37.19 | 30.52,37.19 R43.2 | v33.4,38.83 33.4,38.47 32.16,37.23 30.56,37.23 30.52,37.19
N$6
  Top 0.254: U2.35 32.79,29.93 34.68,28.04 C8.2
N$7
  Top 0.254: U2.31 30.79,29.9 30.99,29.69 30.99,29.06 31.5,28.55 C9.2
N$8
  Top 0.254: U2.27 28.79,29.81 28.04,29.06 28.04,28.02 C10.2
N$9  (via drill 0.35)
  Top 0.305: v17.96,23.43 17.87,23.34 Q1.2
  Bottom 0.305: v17.96,23.43 17.27,22.74 17.27,21.52 D2.A 18.56,20.23 R4.1
N$10  (via drill 0.35)
  Top 0.305: v32.08,23.71 32.08,22.64 Q2.2
  Bottom 0.305: v32.08,23.71 32.08,23.17 31.83,22.92 31.83,21.17 32.31,20.68 D4.A 34.42,20.68 R11.1
N$11
  Top 0.254: U4.2 6.48,25.89 R12.1
  Top 0.508: R12.1 7.42,26.34 8.07,27 C26.1 10.47,27 R23.2
N$12
  Bottom 0.305: U1.10 26.53,51.69 25.52,52.71 23.77,52.71 22.23,51.17 21.38,51.17 C1.2 21.14,50.08 19.02,47.96 R.1
N$13  (via drill 0.35)
  Top 0.254: Q1.4 v13.18,22.18 | v13.18,22.18
  Bottom 0.305: v13.18,22.18 13.18,20.94 13.74,20.39 R5.1 16.19,20.39 D3.A
N$14  (via drill 0.35)
  Top 0.178: U2.7 30.29,39.06 30.54,39.31 30.54,40.13 30.82,40.42 31.71,40.42 32.03,40.74 33.43,40.74 33.94,41.24 35.01,41.24 v35.52,40.74
  Bottom 0.178: v35.52,40.74 35.52,39.63 R24.1
  Bottom 0.254: C27.2 35.55,39.55 R24.1
N$15  (via drill 0.35)
  Top 0.254: U2.6 30.79,38.88 32.22,40.32 34.2,40.32 v34.37,40.48
  Bottom 0.508: C13.1 34.3,40.55 v34.37,40.48
N$16  (via drill 0.35)
  Top 0.305: v27.33,21.95 27.77,22.39 Q2.4
  Bottom 0.305: v27.33,21.95 28.84,20.44 R13.1 30.57,20.44 D5.A
N$17  (via drill 0.25 pad 0.51)
  Top 0.203: U2.42 34.82,33.64 v35,33.46
  Bottom 0.305: BOOT0.P$1 35.4,33.86 v35,33.46 34.29,32.74 R25.1
N$26  (via drill 0.35)
  Top 0.305: Q3.2 45.41,23.61 v45.37,23.65
  Bottom 0.305: v45.37,23.65 45.04,23.32 45.04,21.47 D6.A 45.89,20.61 R15.1
N$27  (via drill 0.35)
  Top 0.305: v40.67,22.36 Q3.4
  Bottom 0.305: v40.67,22.36 40.69,22.36 40.72,22.33 40.72,21.52 41.73,20.51 R16.1 43.84,20.51 D7.A
N$29  (via drill 0.25 pad 0.51)
  Top 0.203: U2.22 25.61,32.14 v25.58,32.11
  Bottom 0.203: R9.1 28.91,33.78 27.16,32.03 R18.2 26.99,32.11 v25.58,32.11
N$30  (via drill 0.25 pad 0.51)
  Top 0.178: U2.46 v33.11,35.64 v33.1,35.64
  Bottom 0.178: R44.1 29.82,34.58 30.7,34.58 31.08,34.2 32.03,34.2 32.41,34.58 32.41,35.35 32.7,35.64 v33.1,35.64 33.54,35.64 R45.2
N$31  (via drill 0.25 pad 0.51)
  Top 0.254: U2.24 26.74,31.14 23.96,28.36 C19.2
  Top 0.305: v51.37,26.16 51.37,24.5 R49.1 | R48.1 37.8,25.53 36.91,26.42 25.15,26.42 24.63,25.91 R47.2
  Top 0.508: C19.2 R47.2 R46.1 | R48.1 39.94,26.47 v40.26,26.47
  Bottom 0.254: v51.37,26.16 51.37,27.38 50.9,27.85 46.81,27.85 45.85,26.88
  Bottom 0.305: v40.26,26.47 40.67,26.88 45.85,26.88
N$32
  Top 0.381: R53.1 49.88,27.84 | 49.88,27.84 51.26,27.84 D10.A | 49.88,27.84
N$33
  Top 0.254: U2.9 29.29,38.4 28.73,38.96 28.73,39.4
  Top 0.406: 28.73,39.4 28.73,40.2 FB2.1
  Top 0.508: FB2.1 29.39,40.45 30.72,41.78 R50.2 30.91,41.84 31.84,42.77 32.91,42.77 D8.1
N$34
  Top 0.635: FB2.2 29.36,42.73 29.36,43.97 R52.1 29.56,44.02 31.17,44.02 C20.1
OP1P  (via drill 0.25 pad 0.51)
  Top 0.203: U2.23 26.25,31.64 v25.76,31.15
  Route2 0.178: 38.49,27.53 40.17,27.53 41.02,26.68
  Route2 0.203: v25.76,31.15 28.04,31.15 28.47,30.72 33.22,30.72 35.03,28.91 37.11,28.91 38.49,27.53 | v52.76,23.1 52.76,23.07 51.61,23.07 48.01,26.68 41.02,26.68
  Bottom 0.203: v52.76,23.1 52.65,22.99 C14.2
  Bottom 0.508: R7.2 C14.2 51.57,22.97 R6.1 R8.2
OP2P  (via drill 0.25 pad 0.51)
  Top 0.178: U2.1 33.86,37.32 v34,37.46
  Route2 0.178: v34,37.46 30.47,37.46 28.37,35.36 25.25,35.36 24.87,34.98 24.08,34.98 23.32,34.22 23.32,32.37 25.27,30.41 25.27,28.4 v25.2,28.33
  Bottom 0.254: C18.2 24.98,22.93 26.11,24.06 26.11,27.67 25.45,28.33 v25.2,28.33
  Bottom 0.508: R22.2 22.52,22.93 C18.2 24.17,22.89 R41.1 R40.2
OP3P  (via drill 0.25 pad 0.51)
  Top 0.203: U2.45 34.97,35.14 35.22,34.89 35.22,34.13 36.4,32.95 36.4,28.86 38,27.26 v38,26.4
  Bottom 0.254: v38,26.4 38.61,25.79 39.29,25.79 40.03,25.05 40.03,23.96 38.97,22.9 C17.2
  Bottom 0.508: R19.2 38.35,22.88 C17.2 38.36,21.39 | R21.1 38.36,21.39 | R20.2 36.76,21.39 38.36,21.39
OUTU  (via drill 0.25 pad 0.51, 0.35)
  Top 0.203: v25.54,22.07 24.6,22.07 23.01,20.48 19.31,20.48 Q1.7_8
  Top 0.254: U2.34 32.29,29.72 32.57,29.44 v32.57,28.96 32.57,28.35 C8.1
  Top 0.305: Q1.3 16.6,21.81 18.34,20.07 Q1.7_8
  Bottom 0.203: v32.57,28.96 32.57,26.99 32.03,26.45 27.76,26.45 27.08,25.76 27.08,23.63 25.54,22.09 v25.54,22.07
  other vias: 14.12,23.7 15.29,23.73 16.43,23.68 14.63,24.57 15.85,24.57 14.15,25.36 15.27,25.36 16.46,25.33 17.91,19.29 17.93,17.89 18.75,18.57 18.77,17.35 19.81,18.04
  pour Top (isolate 0.254, no thermals): 17.55,20.68 17.55,14.59 32.84,-0.7 46.61,-0.7 48.79,1.48 48.79,6.53 45.39,9.94 36.88,9.94 33.68,13.14 25.63,13.14 23.93,14.84 23.93,15.35 23.17,16.11 20.65,16.11 20.3,16.47 20.3,20.12 19.74,20.68
  pour Top (isolate 0.254, no thermals): 16.97,21.44 16.97,25.46 16.64,25.79 14,25.79 13.72,25.51 13.72,23.5 14.02,23.2 16,23.2 16.21,22.99 16.21,21.44
  pour Route2 (isolate 0.254): 13.67,25.56 13.67,23.25 13.67,22.87 14.07,22.46 15.11,21.42 16.1,21.42 16.59,21.42 16.97,21.04 17.37,20.63 17.37,18.93 17.37,17 17.68,16.69 18.06,16.31 19.91,16.31 20.17,16.31 20.5,16.64 20.83,16.97 20.83,19.36 20.83,25.53 20.6,25.76 20.5,25.86 16.66,25.86 13.97,25.86
OUTV  (via drill 0.25 pad 0.51, 0.35)
  Top 0.254: U2.30 30.31,30.44 v30.31,28.71
  Top 0.305: 30.57,22.41 30.57,22.04 32.31,20.3 32.31,19.74 | C9.1 29.8,28.2 v30.31,28.71
  Route2 0.381: v30.31,28.71 30.31,25.29 v29.82,24.8
  other vias: 28.09,23.93 29.26,23.96 30.48,23.93 28.6,24.8 28.12,25.58 29.24,25.58 30.43,25.56 31.88,19.51 31.9,18.12 32.72,18.8 32.74,17.58 33.78,18.27
  pour Top (isolate 0.254, no thermals): 31.52,20.83 31.52,14.23 32.03,13.72 33.78,13.72 37.03,10.47 45.67,10.47 49.23,6.92 49.23,2.22 49.63,1.81 53.09,1.81 54.15,2.88 54.15,8.41 49.02,13.54 39.42,13.54 37.8,15.17 37.8,15.96 37.31,16.44 35.21,16.44 34.42,17.23 34.42,20.4 33.99,20.83
  pour Top (isolate 0.254, no thermals): 30.94,21.67 30.94,25.69 30.61,26.02 27.97,26.02 27.69,25.74 27.69,23.73 27.99,23.43 29.97,23.43 30.18,23.22 30.18,21.67
  pour Route2 (isolate 0.254): 27.69,25.76 27.69,20.99 28.58,20.1 30.73,20.1 31.4,19.44 31.4,17.2 32.08,16.52 34.19,16.52 34.85,17.18 34.85,25.74 34.52,26.07 27.99,26.07
OUTW  (via drill 0.25 pad 0.51, 0.35)
  Top 0.254: U2.26 28.29,29.95 27.97,29.62 27.28,29.62 v26.62,28.96 | C10.1 26.41,28.75 26.61,28.95
  Top 0.305: 45.88,19.71 45.88,20.27 44.13,22.02
  Top 0.381: 26.61,28.95 v26.62,28.96
  Route2 0.178: 27.34,28.24 29.1,28.24 29.72,28.86 29.72,28.96 29.72,29.19 30,29.47 30.56,29.47 31.83,28.2 33.66,28.2 34.7,27.16
  Route2 0.254: v26.62,28.96 27.34,28.24 | v41.81,23.91 41.61,23.71 38.15,23.71 34.7,27.16
  other vias: 42.98,23.93 44.2,23.91 42.32,24.77 43.54,24.77 41.83,25.56 42.95,25.56 44.15,25.53 45.44,19.49 45.47,18.09 46.28,18.78 46.3,17.56 47.35,18.24
  pour Top (isolate 0.254, no thermals): 44.5,21.65 44.5,25.66 44.17,25.99 41.53,25.99 41.35,25.81 41.35,23.6 41.56,23.4 43.54,23.4 43.74,23.2 43.74,21.65
  pour Route2 (isolate 0.254): 41.33,25.84 41.33,21.57 42.24,20.66 44.48,20.66 44.96,20.17 44.96,17.2 45.64,16.52 47.75,16.52 48.41,17.18 48.41,25.74 48.08,26.07 41.56,26.07
  pour Top (isolate 0.254, no thermals): 54.53,8.64 49.25,13.93 46.36,13.93 45.26,13.93 45.03,14.15 45.03,20.76 45.16,20.89 45.24,20.96 45.67,20.96 47.55,20.96 47.85,20.66 48.11,20.4 48.11,19.08 48.11,17.84 49.18,16.77 49.56,16.39 51.18,16.39 59.82,16.39 60.81,15.4 60.81,7.93 60.45,7.58 57.79,4.91 54.97,4.91 54.86,4.91 54.61,5.16 54.53,5.24
PA0  (via drill 0.25 pad 0.51)
  Top 0.178: v26.75,38.67 27.66,38.67 28.29,38.04 U2.11
  Bottom 0.178: 23.7,37.12 23.88,37.29 25.32,37.29 25.6,37.57 25.6,38.21 26.06,38.67 v26.75,38.67
  Bottom 0.254: C46.2 23.52,33.48 23.52,36.93 23.7,37.12
  Bottom 0.381: R56.2 C46.2
PA1
  Top 0.178: U2.12 26.93,37.32 25.55,38.69 24.1,38.69 C28.2
  Top 0.254: C28.2 21.67,37.94 R26.2
PA2  (via drill 0.25 pad 0.51)
  Top 0.178: U2.13 26.81,36.64 25.5,37.95 v24.82,37.95
  Bottom 0.254: v24.82,37.95 22.84,37.95 19.99,35.11 C29.2 19.99,31.74 R28.2
PA3  (via drill 0.25 pad 0.51)
  Top 0.178: U2.3 32.29,38.27 v32.56,38.53 | U2.14 26.42,36.14 25.86,36.71 24.54,36.71 v24.51,36.68
  Bottom 0.178: v32.56,38.53 30.4,38.53 30.25,38.39 27.7,38.39 27.21,37.9 R42.2 26.67,36.68 v24.51,36.68
PA4  (via drill 0.25 pad 0.51)
  Top 0.178: U2.47 34.69,36.14 v35.03,35.81 | U2.15 26.37,35.64 26.02,35.99 v25.47,35.99
  Bottom 0.178: v35.03,35.81 35.03,36.56 34.8,36.79 31.96,36.79 31.52,36.35 28.08,36.35 R44.2 26.17,35.48 25.66,35.99 v25.47,35.99
PA5  (via drill 0.25 pad 0.51)
  Top 0.178: U2.16 26.25,35.14 26.06,35.34 25.66,35.34 24.84,35.34 24.58,35.61 v24.55,35.61
  Top 0.203: U2.21 26.11,32.64 25.91,32.85 v25.05,32.85
  Bottom 0.178: v24.55,35.61 25.15,35.01 25.96,35.01 27.17,33.8
  Bottom 0.203: v25.05,32.85 26.21,32.85 27.17,33.8 R9.2
PA6  (via drill 0.25 pad 0.51, 0.35)
  Top 0.178: U2.17 26.25,34.64 26,34.9 25.34,34.9 v24.79,34.35 | U3.3 43.58,35.73 v43.87,35.44
  Route2 0.178: v40.36,39.58 40.36,38.06 39.98,37.68 36.4,37.68 35.56,36.84 30.58,36.84 28.65,34.91 25.35,34.91 v24.79,34.35
  Bottom 0.178: v43.87,35.44 40.82,38.49 40.82,39.12 v40.36,39.58
PA7  (via drill 0.25 pad 0.51, 0.35)
  Top 0.178: v25.76,34.2 25.81,34.14 U2.18 | U3.13 38.61,36.23 v38.46,36.38
  Route2 0.178: v25.76,34.2 25.81,34.14 28.55,34.14 30.86,36.46 35.51,36.46 35.92,36.05 38.13,36.05 v38.46,36.38
PB1
  Top 0.203: U2.19 26.4,33.64 26.29,33.54 24.41,33.54 23.42,32.54 23.42,29.62 22.48,28.68 20.96,28.68 19.21,26.93 C45.2
  Top 0.508: C45.2 12.25,28.55 R54.2 12.18,30.39 R55.2
PF0
  Top 0.178: U2.4 31.79,38.65 32.6,39.47 35.65,39.47 37.14,37.98 37.14,36.68 37.85,35.97 37.85,34.17 37.14,33.46 37.14,28.71 38.77,27.07 40.6,27.07 40.97,26.7 48.36,26.7 48.57,26.91 48.57,29.24 48.86,29.54 R53.2
PF1
  Top 0.178: U2.5 31.29,38.72 32.4,39.83 36.11,39.83 38.71,37.23 U3.11
SWDCLK  (via drill 0.25 pad 0.51)
  Top 0.178: U2.38 34.59,31.64 35.08,31.16 v35.08,30.66
  Bottom 0.178: v35.08,30.66 35.18,30.66 36.57,32.05 SWDCLK.P$1
SWDIO  (via drill 0.25 pad 0.51)
  Top 0.178: U2.37 33.96,30.74 34.85,29.85 v35.38,29.85
  Bottom 0.178: v35.38,29.85 35.82,29.85 36.31,30.34 SWDIO.P$1
USART2_RX
  Bottom 0.305: U1.14 28.05,53.34 28.05,54.12 26.05,56.12 25.46,56.12 25.05,55.71 U$1.PAD_PD1
USART2_TX  (via drill 0.35)
  Top 0.305: v25.75,55.41 25.46,55.71 U$1.PAD_PU1
  Bottom 0.305: U1.13 27.57,53.88 26.04,55.41 v25.75,55.41
USART3_RX
  Bottom 0.305: U1.23 32.57,53.86 34.38,55.67 U$1.PAD_PD2
USART3_TX  (via drill 0.35)
  Top 0.305: v34.13,56.37 36.45,56.37 U$1.PAD_PU2
  Bottom 0.305: U1.22 32.07,54.31 v34.13,56.37
USART5_RX
  Bottom 0.305: U1.40 31.57,46.17 34.52,43.22 38.16,43.22 38.17,43.2 44.28,43.2 U$1.PAD_PD8
USART5_TX  (via drill 0.35)
  Top 0.305: v36.49,42.51 36.81,42.51 37.17,42.86 43.94,42.86 U$1.PAD_PU8
  Bottom 0.305: U1.41 31.07,45.86 34.42,42.51 v36.49,42.51
USART6_RX  (via drill 0.25 pad 0.51)
  Top 0.305: v20.37,45.3 21.87,46.79 26.47,46.79 v26.77,46.49
  Bottom 0.178: 26.85,46.56 v26.77,46.49
  Bottom 0.254: U1.48 26.85,46.56 | U$1.PAD_PD3 17.31,43.3
  Bottom 0.305: v20.37,45.3 19.31,45.3 17.31,43.3
USART6_TX  (via drill 0.25 pad 0.51)
  Top 0.305: v18.88,43.33 15.75,43.33 U$1.PAD_PU3 | v20.55,44.41 22.38,46.24 25.99,46.24 26.44,45.78 v28.07,45.78
  Bottom 0.178: v28.07,45.78
  Bottom 0.254: U1.47 v28.07,45.78
  Bottom 0.305: v20.55,44.41 19.47,43.33 v18.88,43.33
VDD  (via drill 0.35)
  Top 0.508: FB1.1 R51.1
  Bottom 0.305: U1.31 35.68,49.69 C6.2 36.27,49.1 v36.27,48.87 37.19,49.79 C7.1
  pour Top (no thermals): 45.07,40.02 15.08,40.1 15.08,51.99 29.96,60.69 45,52.1
VDD_L  (via drill 0.25 pad 0.51, 0.35)
  Top 0.178: U3.4 43.41,36.23 43.66,36.48 43.66,37.52 43.44,37.75 42.86,37.75 U3.7 42.84,38.4 v42.9,38.46
  Top 0.254: U2.10 28.79,38.2 26.65,40.34 C22.1
  Top 0.305: U2.48 35.97,36.64 C21.1 | U3.16 40.36,34.14 39.93,33.71 C23.2
  Top 0.381: R47.1 21.46,25.91 v21.29,25.74
  Top 0.457: C22.1 27.22,40.39 27.71,40.89 27.71,44.03 R52.2
  Top 0.508: C23.2 v38.92,32.91 v38.91,32.9 | C21.1 36.15,37.52 35.26,38.41 v34.37,38.41
  Top 0.635: C22.1 26.63,40.41 R51.2 21.25,40.41 19.91,39.06 R27.1 18.85,37.91 v18.82,37.93
  Route2 0.508: v38.91,32.9 42.9,36.89 v42.9,38.46 | 22.23,29.98 22.23,26.68 v21.29,25.74
  Route2 0.635: 34.37,39.55 33.99,39.55 33.71,39.83 32.06,39.83 30.3,38.08 28.68,38.08 26.26,40.49 21.39,40.49 v18.82,37.93 18.82,32.82 18.19,32.19 18.19,30.64 | 34.37,39.55 v38.3,39.55 | v34.37,38.41 34.37,39.55 | 18.19,30.64 v18.19,28.84 | v38.91,32.9 40.06,32.9 41.76,31.2 45.39,31.2 v50.14,26.45 | 18.19,30.64 21.57,30.64 22.23,29.98 v24.51,29.98
  Bottom 0.381: v21.29,25.74 22.41,24.61 R22.1 | R7.1 49.89,26.19 v50.14,26.45 | R57.1 v24.5,29.99 v24.51,29.98 | R29.1 18.19,29.84 v18.19,28.84 | R24.2 38.28,39.58 | 38.28,39.58 v38.3,39.55 | v42.9,38.46 42.9,39.81 42.32,40.39 39.35,40.39 38.53,39.58 38.28,39.58 | 36.91,28.99 37.52,28.99 38.13,29.6 38.13,32.11 v38.91,32.9
  Bottom 0.508: R19.1 35.31,26.01 35.31,28.18 36.12,28.99 36.91,28.99
VDDA  (via drill 0.35)
  Top 0.61: v26.28,44.93 26.22,44.93 25.91,45.24 FB1.2
  Bottom 0.254: U1.5 26.58,49.19 25.27,47.88 C4.2 | U1.6 U1.5 | U1.5 U1.4
  Bottom 0.508: C4.2 25.2,46.37 C2.2 25.19,44.56 C5.1 C3.1
  Bottom 0.635: C5.1 25.55,44.93 v26.28,44.93
VM  (via drill 0.25 pad 0.51, 0.35)
  Top 0.178: 31.4,40.8 30.63,40.8 30.13,40.29 30.13,39.53
  Top 0.203: U2.8 29.79,38.87 v29.6,39.07 29.66,39.07 30.13,39.53 | R50.1 32.55,41.78 31.56,40.8 31.4,40.8
  Top 0.508: R54.1 9.26,28.62 v9.17,28.53
  Route2 0.508: v9.17,28.53 9.17,21.55 v9.15,21.52
  Route2 0.635: v29.6,39.07 27.13,41.54 20.37,41.54 17.48,38.64 17.48,35.54 16.84,34.91 16.84,29.75 11.38,24.29 11.38,22.28 v10.59,21.5
  Bottom 0.508: v29.6,39.07 28.45,40.21 C12.1
  other vias: 12.47,11.97 14.25,11.97 16.03,11.97 16.79,13.24 15.27,13.24 13.49,13.24 11.71,13.24 12.47,14.51 14.25,14.51 16.03,14.51 11.71,15.78 13.49,15.78 15.27,15.78 24.92,17.3 24.92,15.78 25.93,16.54 25.93,15.27 27.2,15.78 27.2,14.26 28.47,15.27 29.74,15.78 29.74,14.26 28.98,16.8 30.51,16.8 29.74,17.81 28.98,18.83 30.51,18.83 38.71,17.2 38.63,15.7 39.52,16.42 39.52,15.15 40.79,15.65 40.79,14.38 42.06,15.15 43.33,15.65 43.43,14.41 42.57,16.67 44.1,16.67 43.33,17.69 42.57,18.7 44.1,18.7 15.8,19.49 16.54,18.65 15.82,17.71
  pour Top (isolate 0.254, no thermals): 7.84,3.27 7.84,11.14 5.49,13.49 5.49,18.45 5.11,18.83 1.23,18.83 0.15,19.91 0.15,26.11 0.79,26.74 3.84,26.74 3.84,24.67 3.46,24.29 3.46,22.38 3.84,22 10.82,22 11.2,21.62 11.2,18.64 11.46,18.38 14.12,18.38 14.44,18.7 14.44,20.48 14.69,20.73 16.73,20.73 16.92,20.54 16.92,14.57 19.97,11.53 19.97,2.76 17.17,-0.03 11.14,-0.03
  pour Top (isolate 0.254, no thermals): 24.79,18.51 28.16,18.51 28.35,18.7 28.35,20.67 28.6,20.92 30.57,20.92 30.82,20.67 30.82,14.19 30.32,13.68 26.06,13.68 24.47,15.27 24.47,18.19
  pour Top (isolate 0.254, no thermals): 38.44,18.51 41.81,18.51 42,18.7 42,20.67 42.25,20.92 44.22,20.92 44.48,20.67 44.48,14.19 44.15,13.86 39.59,13.86 38.23,15.22 38.23,18.29
  pour Route2 (isolate 0.254, rank 2, no thermals): 12.95,20.71 16.43,20.71 21.36,15.78 23.9,15.78 24.41,16.29 24.41,17.81 25.43,18.83 27.71,18.83 28.47,19.59 30.53,19.59 30.89,19.23 30.89,16.9 31.7,16.08 37.8,16.08 38.2,16.49 38.2,18.27 38.41,18.47 41.63,18.47 42.01,18.85 42.01,20.12 42.19,20.3 44.2,20.3 44.55,19.95 44.55,1.05 42.42,-1.09 12.29,-1.09 10.03,1.18 10.03,17.79

## Text on the board
tPlace: 3V3 | P2* | P3 | 3V3 | 3V3 | R | D | C | P1 | P4 | B
bPlace: GND | P2* | P3 | GND | GND | P1 | P4 | Driver Out | H19R00 | 38V | O_W | GND | O_V | VM | O_U